# Altium schematic sheet PCB-Converter-RFM95W.SchDoc
size A4
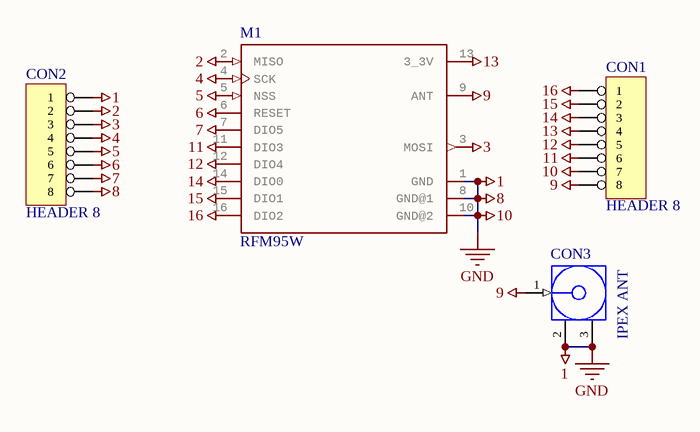
[diagram p0: PCB-Converter-RFM95W.SchDoc]

## Parts
CON1  HEADER 8  [SIP 3D 8]
CON2  HEADER 8  [SIP 3D 8]
CON3  IPEX ANT  [IPEX ANT]
M1  RFM95W  [LoRa RFM95W]

## Nets
1: CON1.7 CON2.1 CON2.8 CON3.2(GND) CON3.3(GND) M1.1(GND) M1.8(GND@1) M1.10(GND@2)  [also labelled 10, 8, GND]
2: CON2.2 M1.2(MISO)
3: CON2.3 M1.3(MOSI)
4: CON2.4 M1.4(SCK)
5: CON2.5 M1.5(NSS)
6: CON2.6 M1.6(RESET)
7: CON2.7 M1.7(DIO5)
9: CON1.8 CON3.1(Signal) M1.9(ANT)
11: CON1.6 M1.11(DIO3)
12: CON1.5 M1.12(DIO4)
13: CON1.4 M1.13(3_3V)
14: CON1.3 M1.14(DIO0)
15: CON1.2 M1.15(DIO1)
16: CON1.1 M1.16(DIO2)

## Library data of the parts
CON3 = IPEX ANT: SMD Male Connector IPEX Antenna IPX 20279-001E
M1 = LoRa RFM95W: HOPERF LoRa RFM95W